# Altium schematic sheet ltk-hall_main_igen.SchDoc: MAIN / CURRENT GEN.
size A3; Organization: Altium Limited; Address1: L3, 12a Rodborough Rd; Address2: Frenchs Forest; Address3: NSW; Address4: Australia 2086; DocumentNumber: 3; SheetNumber: 3; SheetTotal: 6
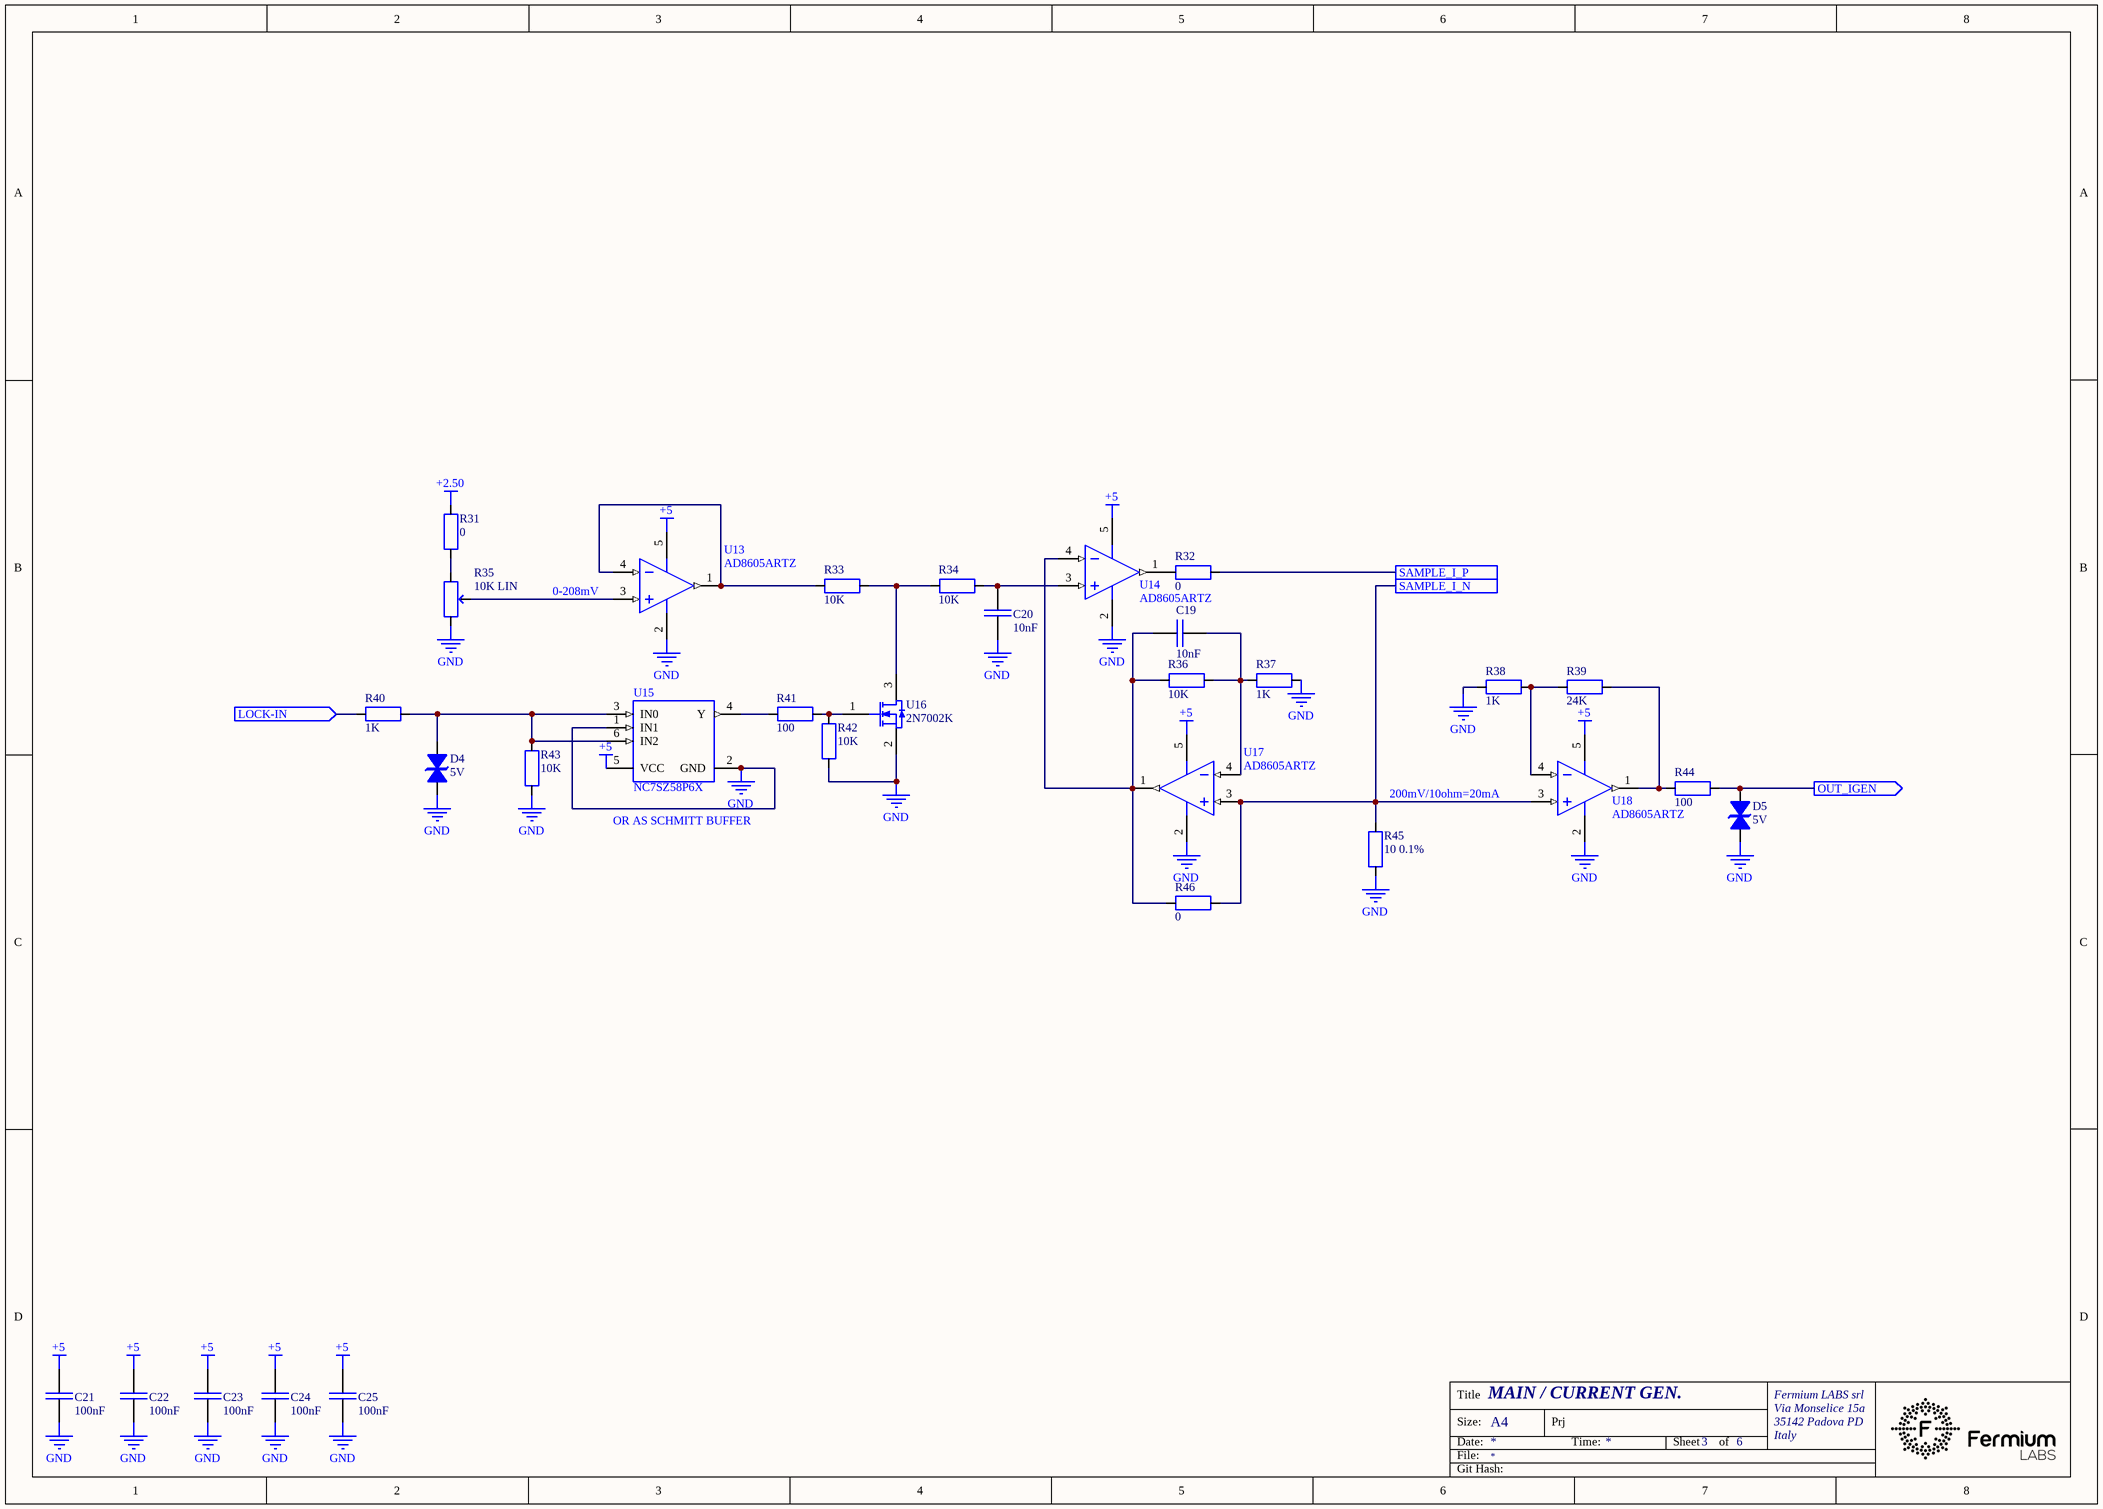
[diagram p0: ltk-hall_main_igen.SchDoc]

## Parts
C19  10nF  [CAP 0603_1608]
C20  10nF  [CAP 0603_1608]
C21  100nF  [CAP 0603_1608]
C22  100nF  [CAP 0603_1608]
C23  100nF  [CAP 0603_1608]
C24  100nF  [CAP 0603_1608]
C25  100nF  [CAP 0603_1608]
D4  5V  [SOD523F]
D5  5V  [SOD523F]
R31  0  [RES 0603_1608]
R32  0  [RES 0603_1608]
R33  10K  [RES 0603_1608]
R34  10K  [RES 0603_1608]
R35  10K LIN  [2EF88547-EDEF-4A49-A522-C215618D4BC7]
R36  10K  [RES 0603_1608]
R37  1K  [RES 0603_1608]
R38  1K  [RES 0603_1608]
R39  24K  [RES 0603_1608]
R40  1K  [RES 0603_1608]
R41  100  [RES 0603_1608]
R42  10K  [RES 0603_1608]
R43  10K  [RES 0603_1608]
R44  100  [RES 0603_1608]
R45  10 0.1%  [RES 0603_1608]
R46  0  [RES 0603_1608]
U13  AD8605ARTZ  [A3DDA0BC-073E-4B18-9613-F713A7EC1E27]
U14  AD8605ARTZ  [A3DDA0BC-073E-4B18-9613-F713A7EC1E27]
U15  NC7SZ58P6X  [CF792C6F-51F3-4C59-9918-AD84EFC14FA6]
U16  2N7002K  [ON SEMI SOT-23-3]
U17  AD8605ARTZ  [A3DDA0BC-073E-4B18-9613-F713A7EC1E27]
U18  AD8605ARTZ  [A3DDA0BC-073E-4B18-9613-F713A7EC1E27]

## Ports
LOCK-IN (in), OUT_IGEN (out), SAMPLE_I_N, SAMPLE_I_P

## Nets
+2.50: R31.2
+5: C21.1 C22.1 C23.1 C24.1 C25.1 U13.5(+V) U14.5(+V) U15.5(VCC) U17.5(+V) U18.5(+V)
GND: C20.2 C21.2 C22.2 C23.2 C24.2 C25.2 D4.2 D5.2 R35.3 R37.2 R38.1 R42.1 R43.1 R45.1 U13.2(-V) U14.2(-V) U15.1(IN1) U15.2(GND) U16.2(S) U17.2(-V) U18.2(-V)
LOCK-IN: R40.2 ; port LOCK-IN
OUT_IGEN: D5.1 R44.2 ; port OUT_IGEN
SAMPLE_I_N: R45.2 R46.2 U17.3(+IN) U18.3(+IN) ; port SAMPLE_I_N
SAMPLE_I_P: R32.2 ; port SAMPLE_I_P
NetC19_1: C19.1 R36.2 R46.1 U14.4(-IN) U17.1(OUT)
NetC19_2: C19.2 R36.1 R37.1 U17.4(-IN)
NetC20_1: C20.1 R34.1 U14.3(+IN)
NetD4_1: D4.1 R40.1 R43.2 U15.3(IN0) U15.6(IN2)
NetR31_1: R31.1 R35.1
NetR32_1: R32.1 U14.1(OUT)
NetR33_1: R33.1 R34.2 U16.3(D)
NetR33_2: R33.2 U13.1(OUT) U13.4(-IN)
NetR35_2: R35.2 U13.3(+IN)
NetR38_2: R38.2 R39.1 U18.4(-IN)
NetR39_2: R39.2 R44.1 U18.1(OUT)
NetR41_1: R41.1 U15.4(Y)
NetR41_2: R41.2 R42.2 U16.1(G)

## Notes on the sheet
- (near U13) 0-208mV
- (near U15) OR AS SCHMITT BUFFER
- (near R45) 200mV/10ohm=20mA
- Title
- Fermium LABS srl
- Size:
- Date:
- File:
- A4
- Prj
- Time:
- Sheet
- of
- Via Monselice 15a
- 35142 Padova PD
- Italy
- Git Hash:

## Library data of the parts
C19 C20 = 84e1ebe1-2230-4987-8231-c47d83fa5f7f: CAP SMD MLCC 10nF 50V 0603 X7R; Manufacturer 1: Yageo; Manufacturer Part Number 1: CC0603KRX7R9BB103; id: 14853; S 1: LCSC; SPN 1: C307477; SPN 2: C100042; Part Number: 84e1ebe1-2230-4987-8231-c47d83fa5f7f; ComponentLink1Description: Datasheet; ComponentLink1URL: http://localhost:8080/static/files/Samsung-Electro-Mechanics-CL10B103KB8NFNC_C3074772019-08-20_080422.792510.pdf?Samsung-Electro-Mechanics-CL10B103KB8NFNC_C307477.pdf; ComponentLink2Description: Datasheet; ComponentLink2URL: http://localhost:8080/static/files/YAGEO-CC0603KRX7R9BB103_C1000422019-08-20_080430.121676.pdf?YAGEO-CC0603KRX7R9BB103_C100042.pdf; Manufacturer 2: Samsung Electro-Mechanics; Manufacturer 3: Yageo; Manufacturer Part Number 2: CL10B103KB8NFNC; Manufacturer Part Number 3: CC0603JRX7R9BB103; Value: 10nF; S 2: LCSC
C21-C25 = 02841f84-ac15-41b5-9e17-915f8f067828: CAP SMD MLCC 100nF 25V 0603 X7R; Manufacturer 1: Samsung Electro-Mechanics; Manufacturer Part Number 1: CL10B104KA8NNNC; id: 14784; S 1: LCSC; SPN 1: C1590; SPN 2: C14663; Part Number: 02841f84-ac15-41b5-9e17-915f8f067828; ComponentLink1Description: Datasheet; ComponentLink1URL: http://localhost:8080/static/files/Samsung-Electro-Mechanics-CL10B104KA8NNNC_C15902019-03-10_215548.826887.pdf?Samsung-Electro-Mechanics-CL10B104KA8NNNC_C1590.pdf; Value: 100nF; Manufacturer 2: Yageo; Manufacturer Part Number 2: CC0603KRX7R9BB104; S 2: LCSC
D4 D5 = daa58212-38e2-4326-a156-8e48058c46f1: DIODE SMD TVS 5V BIDIRECTIONAL SOD-523; Manufacturer 1: Born Semiconductor; Manufacturer Part Number 1: PESD5V0S1BBN; id: 14837; S 1: LCSC; SPN 1: C314264; SPN 2: C97640; Part Number: daa58212-38e2-4326-a156-8e48058c46f1; ComponentLink1Description: Datasheet; ComponentLink1URL: http://localhost:8080/static/files/Nexperia-PESD5V0S1BB-115_C976402019-08-16_201905.624024.pdf?Nexperia-PESD5V0S1BB-115_C97640.pdf; ComponentLink2Description: Datasheet; ComponentLink2URL: http://localhost:8080/static/files/1901051701_Bourne-Semicon-Shenzhen-PESD5V0S1BBN_C3142642019-08-16_201911.992552.pdf?1901051701_Bourne-Semicon-Shenzhen-PESD5V0S1BBN_C314264.pdf; Manufacturer 2: Nexperia; Manufacturer Part Number 2: PESD5V0S1BB,115; Value: 5V; S 2: LCSC
R31 R32 R46 = 6ae227f9-847f-4766-8522-e11a83531204: RES SMD 0 OHM 5% 1/10W 0603; Manufacturer 1: Yageo; Manufacturer Part Number 1: RC0603JR-070RL; id: 11973; S 1: LCSC; SPN 1: C95177; SPN 2: C21189; Part Number: 6ae227f9-847f-4766-8522-e11a83531204; Value: 0; Manufacturer 2: Uniroyal; Manufacturer Part Number 2: 0603WAF0000T5E; S 2: LCSC
R33 R34 R36 R42 R43 = 93242766-ba1d-462d-b58f-ce1dfc4129c8: RES SMD 10K OHM 1% 1/10W 0603; Manufacturer 1: Yageo; Manufacturer Part Number 1: RC0603FR-0710KL; id: 12101; S 1: LCSC; SPN 1: C98220; SPN 2: C25804; Part Number: 93242766-ba1d-462d-b58f-ce1dfc4129c8; Value: 10K; Manufacturer 2: Uniroyal; Manufacturer Part Number 2: 0603WAF1002T5E; S 2: LCSC
R35 = 3df905ea-1e80-4add-859d-a36edd7f106c: POT 10K 20% SHAFT 6mmx7.4mm LIN; Manufacturer 1: ALPS; Manufacturer Part Number 1: RK09K1130A6S; id: 14828; S 1: LCSC; SPN 1: C209770; Part Number: 3df905ea-1e80-4add-859d-a36edd7f106c; ComponentLink1Description: 3D Model; ComponentLink1URL: http://localhost:8080/static/files/RK09K1130A6S2019-08-17_031625.830758.zip?RK09K1130A6S.zip; ComponentLink2Description: Datasheet; ComponentLink2URL: http://localhost:8080/static/files/ALPS-Electric-RK09K1130A6S_C2097702019-08-17_031651.036431.pdf?ALPS-Electric-RK09K1130A6S_C209770.pdf; Value: 10K LIN
R37 R38 R40 = a678220f-9e9d-4863-a833-9993504f723c: RES SMD 1K OHM 1% 1/10W 0603; Manufacturer 1: Yageo; Manufacturer Part Number 1: RC0603FR-071KL; id: 14794; S 1: LCSC; SPN 1: C21190; SPN 2: C22548; Part Number: a678220f-9e9d-4863-a833-9993504f723c; Value: 1K; Manufacturer 2: Uniroyal; Manufacturer Part Number 2: 0603WAF1001T5E; S 2: LCSC
R39 = 89bb9559-07ab-4a9e-ba67-95cb66f30425: RES SMD 24K OHM 1% 1/10W 0603; Manufacturer 1: Yageo; Manufacturer Part Number 1: RC0603FR-0724KL; id: 12540; S 1: LCSC; SPN 1: C137760; Part Number: 89bb9559-07ab-4a9e-ba67-95cb66f30425; Value: 24K
R41 R44 = 0a6c4b74-f837-4563-b154-6e196d753525: RES SMD 100 OHM 1% 1/10W 0603; Manufacturer 1: Yageo; Manufacturer Part Number 1: RC0603FR-07100RL; id: 12301; S 1: LCSC; SPN 1: C105588; SPN 2: C22775; Part Number: 0a6c4b74-f837-4563-b154-6e196d753525; Value: 100; Manufacturer 2: Uniroyal; Manufacturer Part Number 2: 0603WAF1000T5E; S 2: LCSC
R45 = f0166db1-b7e4-4c18-9511-2907615c1c51: RES SMD 10 OHM 0.1% 1/16W 25ppm  0603; Manufacturer 1: Uniroyal; Manufacturer Part Number 1: TC0325B100JT5E; id: 14842; S 1: LCSC; SPN 1: C319923; SPN 2: C146565; Part Number: f0166db1-b7e4-4c18-9511-2907615c1c51; Manufacturer 2: Viking Tech; Manufacturer Part Number 2: AR03BTCX0100; Value: 10 0.1%; S 2: LCSC
U13 U14 U17 U18 = 5610e9ea-bca8-49b2-8e5f-11409231f6a4: IC OPAMP 65uV 1pA RRIO 5V 80mA SOT-23-5; Manufacturer 1: Analog Devices; id: 14830; S 1: LCSC; SPN 1: C9641; Part Number: 5610e9ea-bca8-49b2-8e5f-11409231f6a4; ComponentLink1Description: Datasheet; ComponentLink1URL: http://localhost:8080/static/files/Analog_Devices-AD8605ARTZ-REEL7-datasheet2019-08-16_175825.352099.pdf?Analog_Devices-AD8605ARTZ-REEL7-datasheet.pdf; Manufacturer Part Number 1: AD8605ARTZ
U15 = 22da43c7-1950-42f4-bc93-10d9cca79b4d: IC LOGIC PORT CONFIGURABLE AND, OR, NAND, NOR, XOR, BUFFER, NOT 8ns  74XX58 SC-70; Manufacturer 1: ON Semiconductor; id: 14841; S 1: LCSC; SPN 1: C232804; SPN 2: C7842; Part Number: 22da43c7-1950-42f4-bc93-10d9cca79b4d; ComponentLink1Description: Datasheet; ComponentLink1URL: http://localhost:8080/static/files/1812220431_ON-Semicon-ON-NC7SZ58P6X_C2328042019-08-17_005741.293796.pdf?1812220431_ON-Semicon-ON-NC7SZ58P6X_C232804.pdf; ComponentLink2Description: Datasheet; ComponentLink2URL: http://localhost:8080/static/files/Texas-Instruments-TI-SN74LVC1G58DCKR_C78422019-08-17_005749.189474.pdf?Texas-Instruments-TI-SN74LVC1G58DCKR_C7842.pdf; Manufacturer 2: Texas Instruments; Manufacturer Part Number 1: NC7SZ58P6X; Manufacturer Part Number 2: SN74LVC1G58DCKR; S 2: LCSC
U16 = 3a318f0a-3b94-47d9-91d5-8fc0a2f410e8: MOSFET N-CHANNEL LOGIC LEVEL 300mA 3ohm 60V ESD-PROT 2N7002K SOT-23; Manufacturer 1: ON Semiconductor; Manufacturer Part Number 1: 2N7002KT1G; id: 14846; S 1: LCSC; SPN 1: C81445; SPN 2: C116584; SPN 3: C85047; Part Number: 3a318f0a-3b94-47d9-91d5-8fc0a2f410e8; ComponentLink1Description: Datasheet; ComponentLink1URL: http://localhost:8080/static/files/ON-Semicon-ON-2N7002KT1G_C1165842019-08-17_164859.682835.pdf?ON-Semicon-ON-2N7002KT1G_C116584.pdf; ComponentLink2Description: Datasheet; ComponentLink2URL: http://localhost:8080/static/files/Vishay-Intertech-2N7002K-T1-GE3_C814452019-08-17_164907.199439.pdf?Vishay-Intertech-2N7002K-T1-GE3_C81445.pdf; ComponentLink3Description: Datasheet; ComponentLink3URL: http://localhost:8080/static/files/DATA; Manufacturer 2: Vishay; Manufacturer 3: Diodes Inc.; Manufacturer Part Number 2: 2N7002K-T1-GE3; Manufacturer Part Number 3: 2N7002K-7; S 2: LCSC; S 3: LCSC